# Altium project DeejWithKeypad.PrjPCB
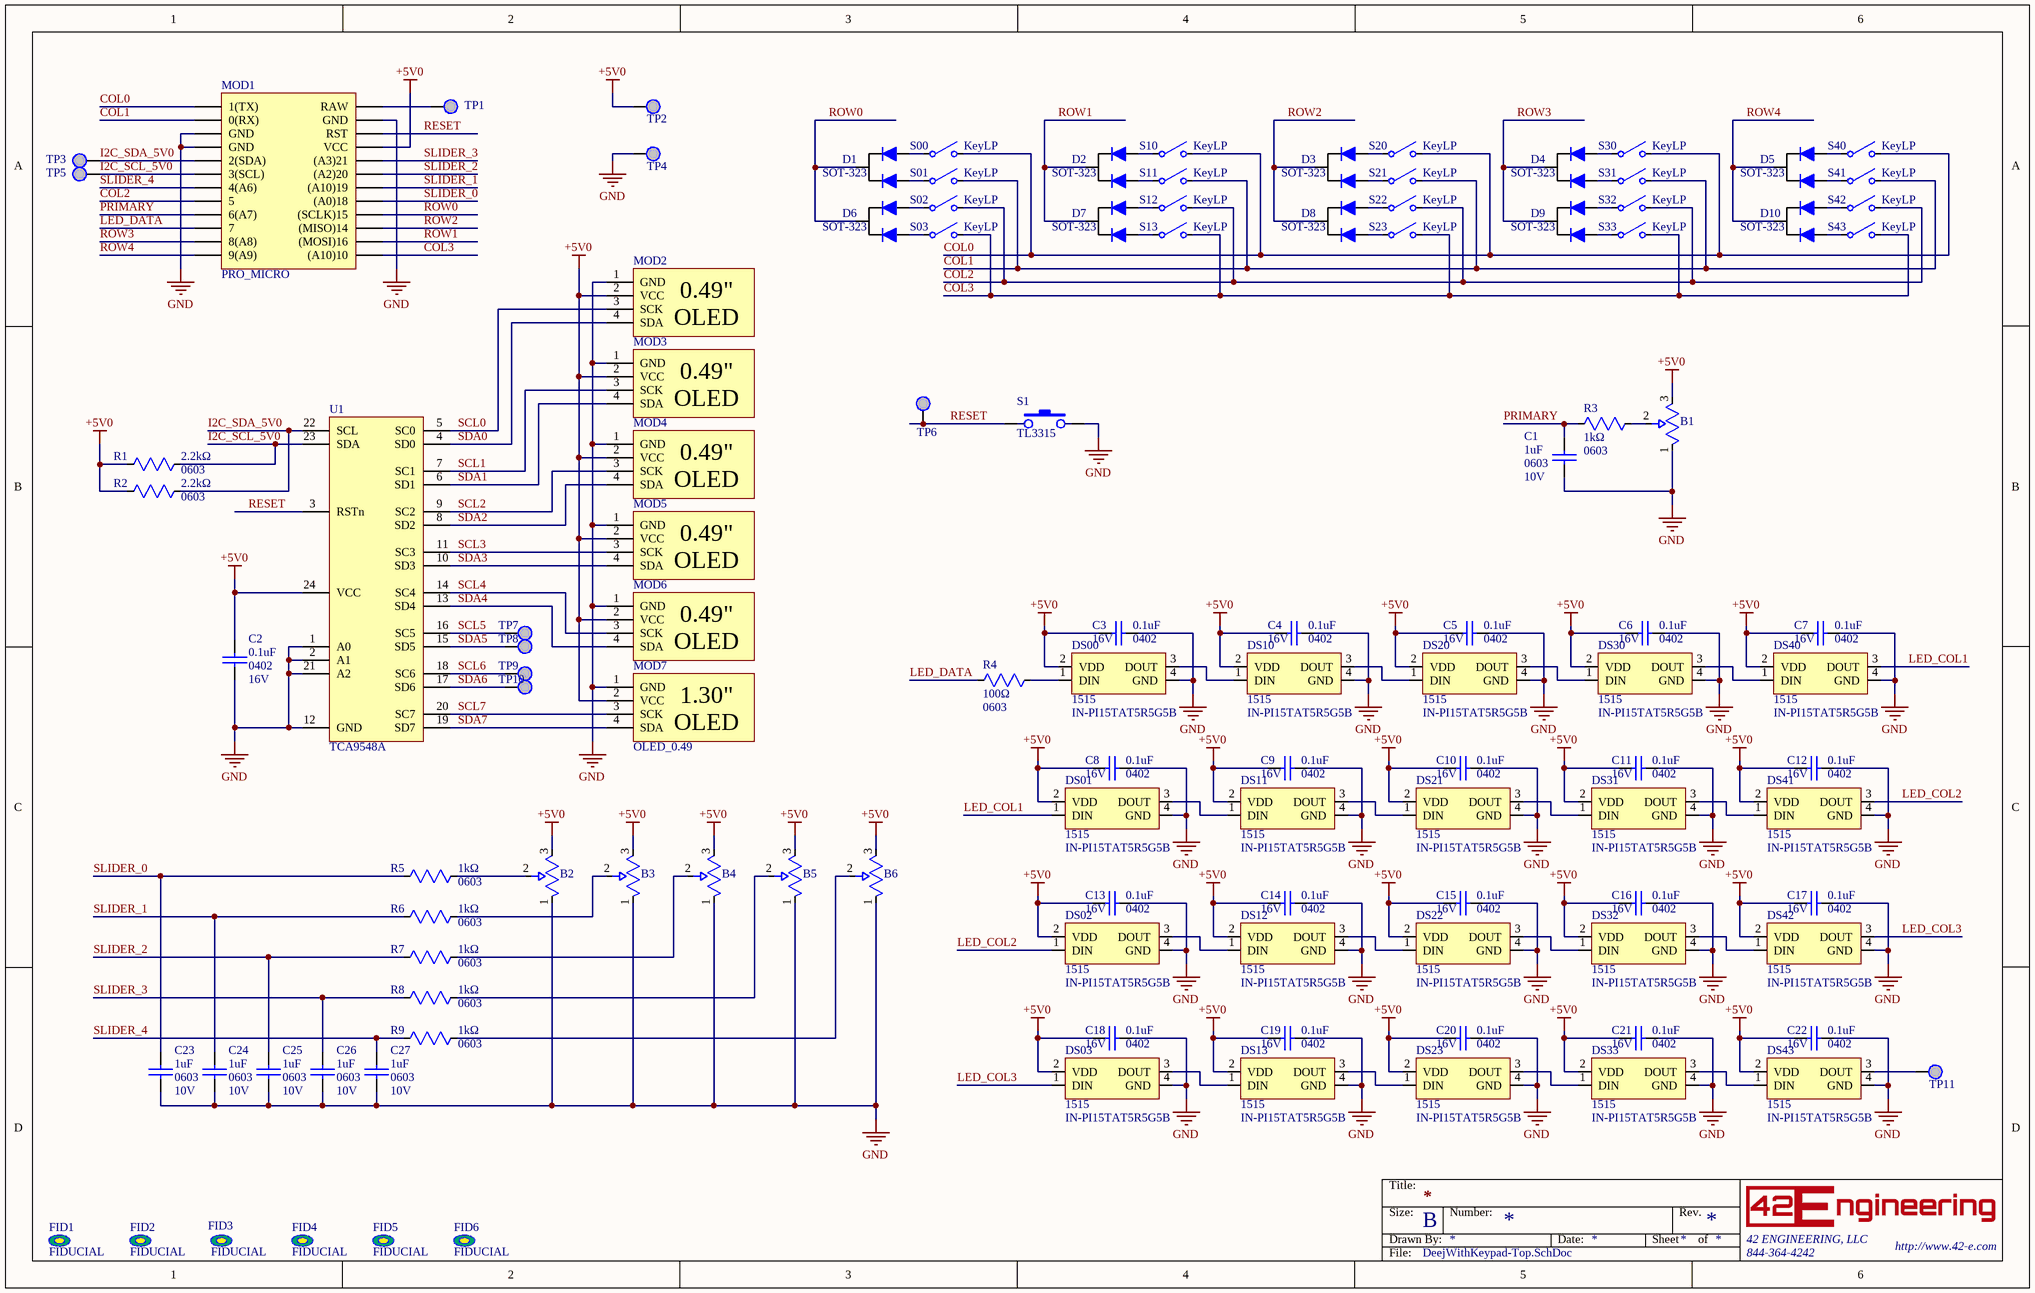
[diagram p0: DeejWithKeypad-Top.SchDoc]
PWB_Revision: 02; PWB_Drawing_Number: DeejBoard; Project_Number: 112; Project_Name: DeejBoard; Part_Number: 02; Date_Code: 20240411
1 sheet, 118 parts. Net scope: hierarchical (ports join the sheet entries above them; power ports are global).
Board file: DeejWithKeypad.PcbDoc

## Sheet DeejWithKeypad-Top.SchDoc
size B

### Parts
B1  Potentiometer  [PT15NVXX]  (value not drawn)
B2  Potentiometer  [PTA30432010CIB104]  (value not drawn)
B3  Potentiometer  [PTA30432010CIB104]  (value not drawn)
B4  Potentiometer  [PTA30432010CIB104]  (value not drawn)
B5  Potentiometer  [PTA30432010CIB104]  (value not drawn)
B6  Potentiometer  [PTA30432010CIB104]  (value not drawn)
C1  value 1uF  Case/Package: 0603  Voltage: 10V  [CAPC1608N]  (hidden comment: Capacitor_Ceramic)
C2  value 0.1uF  Case/Package: 0402  Voltage: 16V  [CAPC1005L]  (hidden comment: Capacitor_Ceramic)
C3  value 0.1uF  Case/Package: 0402  Voltage: 16V  [CAPC1005L]  (hidden comment: Capacitor_Ceramic)
C4  value 0.1uF  Case/Package: 0402  Voltage: 16V  [CAPC1005L]  (hidden comment: Capacitor_Ceramic)
C5  value 0.1uF  Case/Package: 0402  Voltage: 16V  [CAPC1005L]  (hidden comment: Capacitor_Ceramic)
C6  value 0.1uF  Case/Package: 0402  Voltage: 16V  [CAPC1005L]  (hidden comment: Capacitor_Ceramic)
C7  value 0.1uF  Case/Package: 0402  Voltage: 16V  [CAPC1005L]  (hidden comment: Capacitor_Ceramic)
C8  value 0.1uF  Case/Package: 0402  Voltage: 16V  [CAPC1005L]  (hidden comment: Capacitor_Ceramic)
C9  value 0.1uF  Case/Package: 0402  Voltage: 16V  [CAPC1005L]  (hidden comment: Capacitor_Ceramic)
C10  value 0.1uF  Case/Package: 0402  Voltage: 16V  [CAPC1005L]  (hidden comment: Capacitor_Ceramic)
C11  value 0.1uF  Case/Package: 0402  Voltage: 16V  [CAPC1005L]  (hidden comment: Capacitor_Ceramic)
C12  value 0.1uF  Case/Package: 0402  Voltage: 16V  [CAPC1005L]  (hidden comment: Capacitor_Ceramic)
C13  value 0.1uF  Case/Package: 0402  Voltage: 16V  [CAPC1005L]  (hidden comment: Capacitor_Ceramic)
C14  value 0.1uF  Case/Package: 0402  Voltage: 16V  [CAPC1005L]  (hidden comment: Capacitor_Ceramic)
C15  value 0.1uF  Case/Package: 0402  Voltage: 16V  [CAPC1005L]  (hidden comment: Capacitor_Ceramic)
C16  value 0.1uF  Case/Package: 0402  Voltage: 16V  [CAPC1005L]  (hidden comment: Capacitor_Ceramic)
C17  value 0.1uF  Case/Package: 0402  Voltage: 16V  [CAPC1005L]  (hidden comment: Capacitor_Ceramic)
C18  value 0.1uF  Case/Package: 0402  Voltage: 16V  [CAPC1005L]  (hidden comment: Capacitor_Ceramic)
C19  value 0.1uF  Case/Package: 0402  Voltage: 16V  [CAPC1005L]  (hidden comment: Capacitor_Ceramic)
C20  value 0.1uF  Case/Package: 0402  Voltage: 16V  [CAPC1005L]  (hidden comment: Capacitor_Ceramic)
C21  value 0.1uF  Case/Package: 0402  Voltage: 16V  [CAPC1005L]  (hidden comment: Capacitor_Ceramic)
C22  value 0.1uF  Case/Package: 0402  Voltage: 16V  [CAPC1005L]  (hidden comment: Capacitor_Ceramic)
C23  value 1uF  Case/Package: 0603  Voltage: 10V  [CAPC1608N]  (hidden comment: Capacitor_Ceramic)
C24  value 1uF  Case/Package: 0603  Voltage: 10V  [CAPC1608N]  (hidden comment: Capacitor_Ceramic)
C25  value 1uF  Case/Package: 0603  Voltage: 10V  [CAPC1608N]  (hidden comment: Capacitor_Ceramic)
C26  value 1uF  Case/Package: 0603  Voltage: 10V  [CAPC1608N]  (hidden comment: Capacitor_Ceramic)
C27  value 1uF  Case/Package: 0603  Voltage: 10V  [CAPC1608N]  (hidden comment: Capacitor_Ceramic)
D1  Case/Package: SOT-323  [DIODE_CC_SOT323]  (hidden comment: Diode_Standard_CC)
D2  Case/Package: SOT-323  [DIODE_CC_SOT323]  (hidden comment: Diode_Standard_CC)
D3  Case/Package: SOT-323  [DIODE_CC_SOT323]  (hidden comment: Diode_Standard_CC)
D4  Case/Package: SOT-323  [DIODE_CC_SOT323]  (hidden comment: Diode_Standard_CC)
D5  Case/Package: SOT-323  [DIODE_CC_SOT323]  (hidden comment: Diode_Standard_CC)
D6  Case/Package: SOT-323  [DIODE_CC_SOT323]  (hidden comment: Diode_Standard_CC)
D7  Case/Package: SOT-323  [DIODE_CC_SOT323]  (hidden comment: Diode_Standard_CC)
D8  Case/Package: SOT-323  [DIODE_CC_SOT323]  (hidden comment: Diode_Standard_CC)
D9  Case/Package: SOT-323  [DIODE_CC_SOT323]  (hidden comment: Diode_Standard_CC)
D10  Case/Package: SOT-323  [DIODE_CC_SOT323]  (hidden comment: Diode_Standard_CC)
DS00  PCB Footprint: 1515  [IN-PI15TAT5R5G5B]  (hidden comment: IN-PI15TAT5R5G5B)
DS01  PCB Footprint: 1515  [IN-PI15TAT5R5G5B]  (hidden comment: IN-PI15TAT5R5G5B)
DS02  PCB Footprint: 1515  [IN-PI15TAT5R5G5B]  (hidden comment: IN-PI15TAT5R5G5B)
DS03  PCB Footprint: 1515  [IN-PI15TAT5R5G5B]  (hidden comment: IN-PI15TAT5R5G5B)
DS10  PCB Footprint: 1515  [IN-PI15TAT5R5G5B]  (hidden comment: IN-PI15TAT5R5G5B)
DS11  PCB Footprint: 1515  [IN-PI15TAT5R5G5B]  (hidden comment: IN-PI15TAT5R5G5B)
DS12  PCB Footprint: 1515  [IN-PI15TAT5R5G5B]  (hidden comment: IN-PI15TAT5R5G5B)
DS13  PCB Footprint: 1515  [IN-PI15TAT5R5G5B]  (hidden comment: IN-PI15TAT5R5G5B)
DS20  PCB Footprint: 1515  [IN-PI15TAT5R5G5B]  (hidden comment: IN-PI15TAT5R5G5B)
DS21  PCB Footprint: 1515  [IN-PI15TAT5R5G5B]  (hidden comment: IN-PI15TAT5R5G5B)
DS22  PCB Footprint: 1515  [IN-PI15TAT5R5G5B]  (hidden comment: IN-PI15TAT5R5G5B)
DS23  PCB Footprint: 1515  [IN-PI15TAT5R5G5B]  (hidden comment: IN-PI15TAT5R5G5B)
DS30  PCB Footprint: 1515  [IN-PI15TAT5R5G5B]  (hidden comment: IN-PI15TAT5R5G5B)
DS31  PCB Footprint: 1515  [IN-PI15TAT5R5G5B]  (hidden comment: IN-PI15TAT5R5G5B)
DS32  PCB Footprint: 1515  [IN-PI15TAT5R5G5B]  (hidden comment: IN-PI15TAT5R5G5B)
DS33  PCB Footprint: 1515  [IN-PI15TAT5R5G5B]  (hidden comment: IN-PI15TAT5R5G5B)
DS40  PCB Footprint: 1515  [IN-PI15TAT5R5G5B]  (hidden comment: IN-PI15TAT5R5G5B)
DS41  PCB Footprint: 1515  [IN-PI15TAT5R5G5B]  (hidden comment: IN-PI15TAT5R5G5B)
DS42  PCB Footprint: 1515  [IN-PI15TAT5R5G5B]  (hidden comment: IN-PI15TAT5R5G5B)
DS43  PCB Footprint: 1515  [IN-PI15TAT5R5G5B]  (hidden comment: IN-PI15TAT5R5G5B)
FID1  FIDUCIAL  [FIDUCIAL_1mm]  (no BOM)
FID2  FIDUCIAL  [FIDUCIAL_1mm]  (no BOM)
FID3  FIDUCIAL  [FIDUCIAL_1mm]  (no BOM)
FID4  FIDUCIAL  [FIDUCIAL_1mm]  (no BOM)
FID5  FIDUCIAL  [FIDUCIAL_1mm]  (no BOM)
FID6  FIDUCIAL  [FIDUCIAL_1mm]  (no BOM)
MOD1  PRO_MICRO  [PRO_MICRO]
MOD2  OLED_0.49  [OLED_0.49]  (value not drawn)
MOD3  OLED_0.49  [OLED_0.49]  (value not drawn)
MOD4  OLED_0.49  [OLED_0.49]  (value not drawn)
MOD5  OLED_0.49  [OLED_0.49]  (value not drawn)
MOD6  OLED_0.49  [OLED_0.49]  (value not drawn)
MOD7  OLED_0.49  [OLED_1.30]
R1  value 2.2kΩ  Case/Package: 0603  [RESC1608N]  (hidden comment: Resistor)
R2  value 2.2kΩ  Case/Package: 0603  [RESC1608N]  (hidden comment: Resistor)
R3  value 1kΩ  Case/Package: 0603  [RESC1608N]  (hidden comment: Resistor)
R4  value 100Ω  Case/Package: 0603  [RESC1608N]  (hidden comment: Resistor)
R5  value 1kΩ  Case/Package: 0603  [RESC1608N]  (hidden comment: Resistor)
R6  value 1kΩ  Case/Package: 0603  [RESC1608N]  (hidden comment: Resistor)
R7  value 1kΩ  Case/Package: 0603  [RESC1608N]  (hidden comment: Resistor)
R8  value 1kΩ  Case/Package: 0603  [RESC1608N]  (hidden comment: Resistor)
R9  value 1kΩ  Case/Package: 0603  [RESC1608N]  (hidden comment: Resistor)
S00  KeyLP  [Keyswitch]  (no BOM)
S01  KeyLP  [Keyswitch]  (no BOM)
S1  TL3315  [TL3315]
S02  KeyLP  [Keyswitch]  (no BOM)
S03  KeyLP  [Keyswitch]  (no BOM)
S10  KeyLP  [Keyswitch]  (no BOM)
S11  KeyLP  [Keyswitch]  (no BOM)
S12  KeyLP  [Keyswitch]  (no BOM)
S13  KeyLP  [Keyswitch]  (no BOM)
S20  KeyLP  [Keyswitch]  (no BOM)
S21  KeyLP  [Keyswitch]  (no BOM)
S22  KeyLP  [Keyswitch]  (no BOM)
S23  KeyLP  [Keyswitch]  (no BOM)
S30  KeyLP  [Keyswitch]  (no BOM)
S31  KeyLP  [Keyswitch]  (no BOM)
S32  KeyLP  [Keyswitch]  (no BOM)
S33  KeyLP  [Keyswitch]  (no BOM)
S40  KeyLP  [Keyswitch]  (no BOM)
S41  KeyLP  [Keyswitch]  (no BOM)
S42  KeyLP  [Keyswitch]  (no BOM)
S43  KeyLP  [Keyswitch]  (no BOM)
TP1  Standard (NO BOM) fooprints, SMD and TH  [Testpoint - Thruhole]  (value not drawn)
TP2  Standard (NO BOM) fooprints, SMD and TH  [Testpoint - Thruhole]  (value not drawn)
TP3  Standard (NO BOM) fooprints, SMD and TH  [Testpoint - Thruhole]  (value not drawn)
TP4  Standard (NO BOM) fooprints, SMD and TH  [Testpoint - Thruhole]  (value not drawn)
TP5  Standard (NO BOM) fooprints, SMD and TH  [Testpoint - Thruhole]  (value not drawn)
TP6  Standard (NO BOM) fooprints, SMD and TH  [Testpoint - Thruhole]  (value not drawn)
TP7  Standard (NO BOM) fooprints, SMD and TH  [Testpoint - Thruhole]  (value not drawn)
TP8  Standard (NO BOM) fooprints, SMD and TH  [Testpoint - Thruhole]  (value not drawn)
TP9  Standard (NO BOM) fooprints, SMD and TH  [Testpoint - Thruhole]  (value not drawn)
TP10  Standard (NO BOM) fooprints, SMD and TH  [Testpoint - Thruhole]  (value not drawn)
TP11  Standard (NO BOM) fooprints, SMD and TH  [Testpoint - Thruhole]  (value not drawn)
U1  TCA9548A  [TSOP65P640X120-24N]

### Nets
+5V0: B1.3 B2.3 B3.3 B4.3 B5.3 B6.3 C2.1 C3.2 C4.2 C5.2 C6.2 C7.2 C8.2 C9.2 C10.2 C11.2 C12.2 C13.2 C14.2 C15.2 C16.2 C17.2 C18.2 C19.2 C20.2 C21.2 C22.2 DS00.2(VDD) DS01.2(VDD) DS02.2(VDD) DS03.2(VDD) DS10.2(VDD) DS11.2(VDD) DS12.2(VDD) DS13.2(VDD) DS20.2(VDD) DS21.2(VDD) DS22.2(VDD) DS23.2(VDD) DS30.2(VDD) DS31.2(VDD) DS32.2(VDD) DS33.2(VDD) DS40.2(VDD) DS41.2(VDD) DS42.2(VDD) DS43.2(VDD) MOD1.21(VCC) MOD2.2(VCC) MOD3.2(VCC) MOD4.2(VCC) MOD5.2(VCC) MOD6.2(VCC) MOD7.2(VCC) R1.1 R2.1 TP2.1 U1.24(VCC)
GND: B1.1 B2.1 B3.1 B4.1 B5.1 B6.1 C1.1 C2.2 C3.1 C4.1 C5.1 C6.1 C7.1 C8.1 C9.1 C10.1 C11.1 C12.1 C13.1 C14.1 C15.1 C16.1 C17.1 C18.1 C19.1 C20.1 C21.1 C22.1 C23.1 C24.1 C25.1 C26.1 C27.1 DS00.4(GND) DS01.4(GND) DS02.4(GND) DS03.4(GND) DS10.4(GND) DS11.4(GND) DS12.4(GND) DS13.4(GND) DS20.4(GND) DS21.4(GND) DS22.4(GND) DS23.4(GND) DS30.4(GND) DS31.4(GND) DS32.4(GND) DS33.4(GND) DS40.4(GND) DS41.4(GND) DS42.4(GND) DS43.4(GND) MOD1.3(GND) MOD1.4(GND) MOD1.23(GND) MOD2.1(GND) MOD3.1(GND) MOD4.1(GND) MOD5.1(GND) MOD6.1(GND) MOD7.1(GND) S1.B TP4.1 U1.1(A0) U1.2(A1) U1.12(GND) U1.21(A2)
COL0: MOD1.1(1(TX)) S00.2(NO) S10.2(NO) S20.2(NO) S30.2(NO) S40.2(NO)
COL1: MOD1.2(0(RX)) S01.2(NO) S11.2(NO) S21.2(NO) S31.2(NO) S41.2(NO)
COL2: MOD1.8(5) S02.2(NO) S12.2(NO) S22.2(NO) S32.2(NO) S42.2(NO)
COL3: MOD1.13((A10)10) S03.2(NO) S13.2(NO) S23.2(NO) S33.2(NO) S43.2(NO)
I2C_SCL_5V0: MOD1.6(3(SCL)) R1.2 TP5.1 U1.23(SDA)
I2C_SDA_5V0: MOD1.5(2(SDA)) R2.2 TP3.1 U1.22(SCL)
LED_COL1: DS01.1(DIN) DS40.3(DOUT)
LED_COL2: DS02.1(DIN) DS41.3(DOUT)
LED_COL3: DS03.1(DIN) DS42.3(DOUT)
LED_DATA: MOD1.10(7) R4.1
PRIMARY: C1.2 MOD1.9(6(A7)) R3.1
RESET: MOD1.22(RST) S1.A TP6.1 U1.3(RSTn)
ROW0: D1.K D6.K MOD1.16((SCLK)15)
ROW1: D2.K D7.K MOD1.14((MOSI)16)
ROW2: D3.K D8.K MOD1.15((MISO)14)
ROW3: D4.K D9.K MOD1.11(8(A8))
ROW4: D5.K D10.K MOD1.12(9(A9))
SCL0: MOD2.3(SCK) U1.5(SC0)
SCL1: MOD3.3(SCK) U1.7(SC1)
SCL2: MOD4.3(SCK) U1.9(SC2)
SCL3: MOD5.3(SCK) U1.11(SC3)
SCL4: MOD6.3(SCK) U1.14(SC4)
SCL5: TP7.1 U1.16(SC5)
SCL6: TP9.1 U1.18(SC6)
SCL7: MOD7.3(SCK) U1.20(SC7)
SDA0: MOD2.4(SDA) U1.4(SD0)
SDA1: MOD3.4(SDA) U1.6(SD1)
SDA2: MOD4.4(SDA) U1.8(SD2)
SDA3: MOD5.4(SDA) U1.10(SD3)
SDA4: MOD6.4(SDA) U1.13(SD4)
SDA5: TP8.1 U1.15(SD5)
SDA6: TP10.1 U1.17(SD6)
SDA7: MOD7.4(SDA) U1.19(SD7)
SLIDER_0: C23.2 MOD1.17((A0)18) R5.1
SLIDER_1: C24.2 MOD1.18((A10)19) R6.1
SLIDER_2: C25.2 MOD1.19((A2)20) R7.1
SLIDER_3: C26.2 MOD1.20((A3)21) R8.1
SLIDER_4: C27.2 MOD1.7(4(A6)) R9.1
NetB1_2: B1.2 R3.2
NetB2_2: B2.2 R5.2
NetB3_2: B3.2 R6.2
NetB4_2: B4.2 R7.2
NetB5_2: B5.2 R8.2
NetB6_2: B6.2 R9.2
NetD1_A1: D1.A1 S00.1(COMMON)
NetD1_A2: D1.A2 S01.1(COMMON)
NetD2_A1: D2.A1 S10.1(COMMON)
NetD2_A2: D2.A2 S11.1(COMMON)
NetD3_A1: D3.A1 S20.1(COMMON)
NetD3_A2: D3.A2 S21.1(COMMON)
NetD4_A1: D4.A1 S30.1(COMMON)
NetD4_A2: D4.A2 S31.1(COMMON)
NetD5_A1: D5.A1 S40.1(COMMON)
NetD5_A2: D5.A2 S41.1(COMMON)
NetD6_A1: D6.A1 S02.1(COMMON)
NetD6_A2: D6.A2 S03.1(COMMON)
NetD7_A1: D7.A1 S12.1(COMMON)
NetD7_A2: D7.A2 S13.1(COMMON)
NetD8_A1: D8.A1 S22.1(COMMON)
NetD8_A2: D8.A2 S23.1(COMMON)
NetD9_A1: D9.A1 S32.1(COMMON)
NetD9_A2: D9.A2 S33.1(COMMON)
NetD10_A1: D10.A1 S42.1(COMMON)
NetD10_A2: D10.A2 S43.1(COMMON)
NetDS00_1: DS00.1(DIN) R4.2
NetDS00_3: DS00.3(DOUT) DS10.1(DIN)
NetDS01_3: DS01.3(DOUT) DS11.1(DIN)
NetDS02_3: DS02.3(DOUT) DS12.1(DIN)
NetDS03_3: DS03.3(DOUT) DS13.1(DIN)
NetDS10_3: DS10.3(DOUT) DS20.1(DIN)
NetDS11_3: DS11.3(DOUT) DS21.1(DIN)
NetDS12_3: DS12.3(DOUT) DS22.1(DIN)
NetDS13_3: DS13.3(DOUT) DS23.1(DIN)
NetDS20_3: DS20.3(DOUT) DS30.1(DIN)
NetDS21_3: DS21.3(DOUT) DS31.1(DIN)
NetDS22_3: DS22.3(DOUT) DS32.1(DIN)
NetDS23_3: DS23.3(DOUT) DS33.1(DIN)
NetDS30_3: DS30.3(DOUT) DS40.1(DIN)
NetDS31_3: DS31.3(DOUT) DS41.1(DIN)
NetDS32_3: DS32.3(DOUT) DS42.1(DIN)
NetDS33_3: DS33.3(DOUT) DS43.1(DIN)
NetDS43_3: DS43.3(DOUT) TP11.1
NetMOD1_24: MOD1.24(RAW) TP1.1

### Notes on the sheet
- Title:
- Size:
- Drawn By:
- B
- Number:
- Date:
- Sheet
- Rev.
- of
- 42 ENGINEERING, LLC
- File:
- 844-364-4242
- http://www.42-e.com
- (in symbol OLED_0.49) 0.49" / OLED; 1.30" / OLED

### Library data of the parts
B1-B6 = PT10MH01-103A2020-S: POT 10K OHM LINEAR; Part Number: PT10MH01-103A2020-S; Type: Standard
C1 C23-C27 = CC0603JRX7R6BB105: CAP CER 1UF 10V X7R 0603; Manufacturer 1: Yageo; Part Number: CC0603JRX7R6BB105; Supplier 1: Digi-Key; Supplier Part Number 1: 311-3484-1-ND; Manufacturer Part Number 1: CC0603JRX7R6BB105
C2-C22 = CC0402KRX7R7BB104: CAP CER 0.1UF 16V X7R 0402; Manufacturer 1: Yageo; Part Number: CC0402KRX7R7BB104; Supplier Part Number 1: 311-1338-1-ND; Manufacturer Part Number 1: CC0402KRX7R7BB104
D1-D10 = BAV70WT1G: DIODE ARRAY GP 100V 200MA SC70-3; Manufacturer 1: ON Semiconductor; Part Number: BAV70WT1G; Supplier 1: Digi-Key; Supplier Part Number 1: BAV70WT1GOSCT-ND
DS00 DS01 DS02 DS03 DS10-DS13 DS20-DS23 DS30-DS33 DS40-DS43 = IN-PI15TAT5R5G5B: Addressable Lighting - 1 LED Discrete Red, Green, Blue (RGB) 1.50mm L x 1.50mm W; Manufacturer: Inolux; Unit: EA; RoHS: Yes; Supplier 1: Digikey; Supplier Part Number 1: 1830-IN-PI15TAT5R5G5BCT-ND; Part Number: IN-PI15TAT5R5G5B
FID1-FID6 = FIDUCIAL: 1MM Fiducial
R1 R2 = RES0603F2K20: Resistor, 2.2kΩ, 1%, 0.1W, 0603; Manufacturer 1: Yageo; Manufacturer Part Number 1: RC0603FR-072K2L; Part Number: RES0603F2K20
R3 R5-R9 = RES0603F1K00: Resistor, 1kΩ, 1%, 0.1W, 0603; Manufacturer 1: Yageo; Manufacturer Part Number 1: RC0603FR-071KL; Part Number: RES0603F1K00
R4 = RES0603F100R: Resistor, 100Ω, 1%, 0.1W, 0603; Manufacturer 1: Yageo; Manufacturer Part Number 1: RC0603FR-07100RL; Part Number: RES0603F100R
S00 S01 S02 S03 S10-S13 S20-S23 S30-S33 S40-S43 = Switch - Solder Bridge: Part Number: Switch - Solder Bridge; Type: Standard (No BOM)
TP1-TP11 = TP - Off Wire - All Footprints Added: Part Number: TP - Off Wire - All Footprints Added; Type: Standard (No BOM)